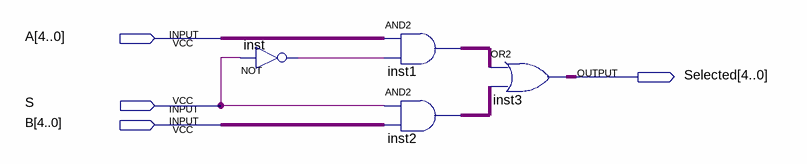
[diagram p0: schematic sheet]
// Quartus schematic Mux2.bdf as structural Verilog: 4 symbols, 4 pins
module Mux2 (
  input  [4:0] A,
  input  S,
  input  [4:0] B,
  output [4:0] Selected
);

  wire inst_out;
  wire [4:0] inst1_out, inst2_out;

  not inst (inst_out, S);
  assign inst1_out = A & {5{inst_out}};  // AND2 inst1, 5 bits wide
  assign inst2_out = {5{S}} & B;  // AND2 inst2, 5 bits wide
  assign Selected = inst1_out | inst2_out;  // OR2 inst3, 5 bits wide
endmodule
